# Altium schematic sheet PROC_partD_(VSS).SchDoc
size A
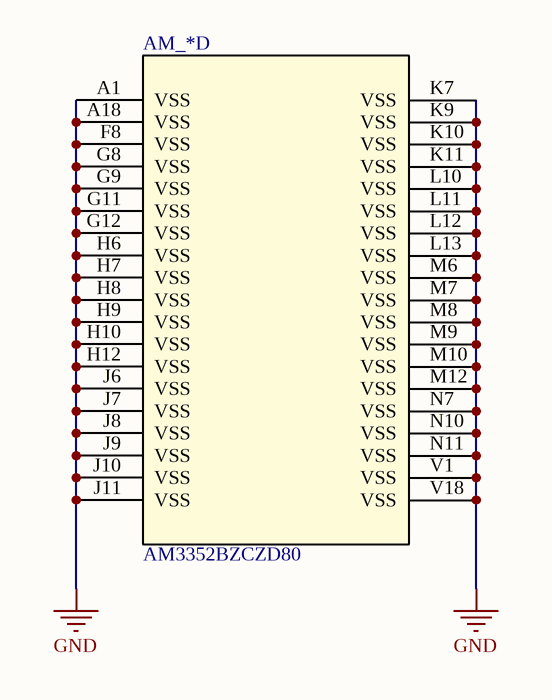
[diagram p0: PROC_partD_(VSS).SchDoc]

## Parts
AM_*  AM3352BZCZD80  [BGA324C80P18X18_800X1508X1508]  (part D of 4)

## Nets
GND: AM_*.A1(VSS) AM_*.A18(VSS) AM_*.F8(VSS) AM_*.G8(VSS) AM_*.G9(VSS) AM_*.G11(VSS) AM_*.G12(VSS) AM_*.H6(VSS) AM_*.H7(VSS) AM_*.H8(VSS) AM_*.H9(VSS) AM_*.H10(VSS) AM_*.H12(VSS) AM_*.J6(VSS) AM_*.J7(VSS) AM_*.J8(VSS) AM_*.J9(VSS) AM_*.J10(VSS) AM_*.J11(VSS) AM_*.K7(VSS) AM_*.K9(VSS) AM_*.K10(VSS) AM_*.K11(VSS) AM_*.L10(VSS) AM_*.L11(VSS) AM_*.L12(VSS) AM_*.L13(VSS) AM_*.M6(VSS) AM_*.M7(VSS) AM_*.M8(VSS) AM_*.M9(VSS) AM_*.M10(VSS) AM_*.M12(VSS) AM_*.N7(VSS) AM_*.N10(VSS) AM_*.N11(VSS) AM_*.V1(VSS) AM_*.V18(VSS)

## Library data of the parts
AM_* = AM3352BZCZD80: Microprocesseur ARM; Fabricant: Texas Instrument; Fournisseur: Farnell; RefFabricant: AM3352BZCZ100; RefFournisseur: 2494119; Value: Value